# Altium schematic sheet ark.SchDoc
size A4
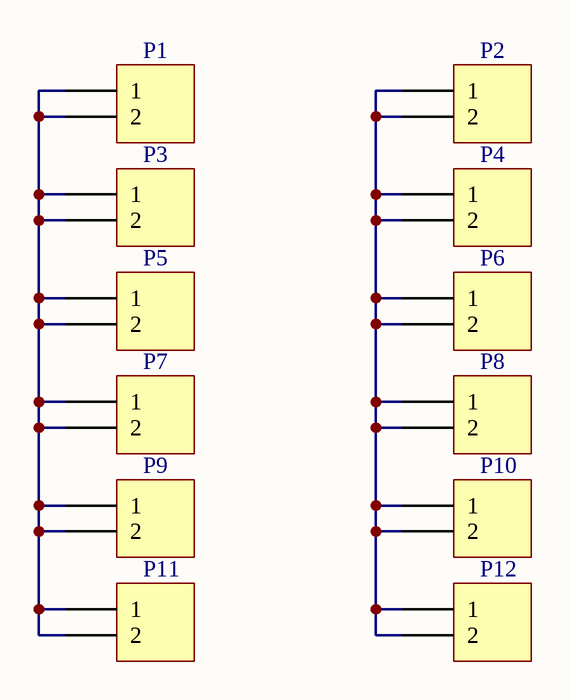
[diagram p0: ark.SchDoc]

## Parts
P1  ARK 2-Pin  [ARK-5mm-2pin]  (value not drawn)
P2  ARK 2-Pin  [ARK-5mm-2pin]  (value not drawn)
P3  ARK 2-Pin  [ARK-5mm-2pin]  (value not drawn)
P4  ARK 2-Pin  [ARK-5mm-2pin]  (value not drawn)
P5  ARK 2-Pin  [ARK-5mm-2pin]  (value not drawn)
P6  ARK 2-Pin  [ARK-5mm-2pin]  (value not drawn)
P7  ARK 2-Pin  [ARK-5mm-2pin]  (value not drawn)
P8  ARK 2-Pin  [ARK-5mm-2pin]  (value not drawn)
P9  ARK 2-Pin  [ARK-5mm-2pin]  (value not drawn)
P10  ARK 2-Pin  [ARK-5mm-2pin]  (value not drawn)
P11  ARK 2-Pin  [ARK-5mm-2pin]  (value not drawn)
P12  ARK 2-Pin  [ARK-5mm-2pin]  (value not drawn)

## Nets
NetP1_1: P1.1 P1.2 P3.1 P3.2 P5.1 P5.2 P7.1 P7.2 P9.1 P9.2 P11.1 P11.2
NetP2_1: P2.1 P2.2 P4.1 P4.2 P6.1 P6.2 P8.1 P8.2 P10.1 P10.2 P12.1 P12.2